# EasyEDA Pro project ProPrj_智能小车.epro

# Schematic Schematic1
Board Name: Board1; Create Date: 2025-06-21; Page Name: P1; Project Name: 智能小车; Schematic Name: Schematic1; Update Date: 2025-06-22; Company: 西安电子科技大学; Drawed: 王舒贤; Page Size: A4; Version: V1.0
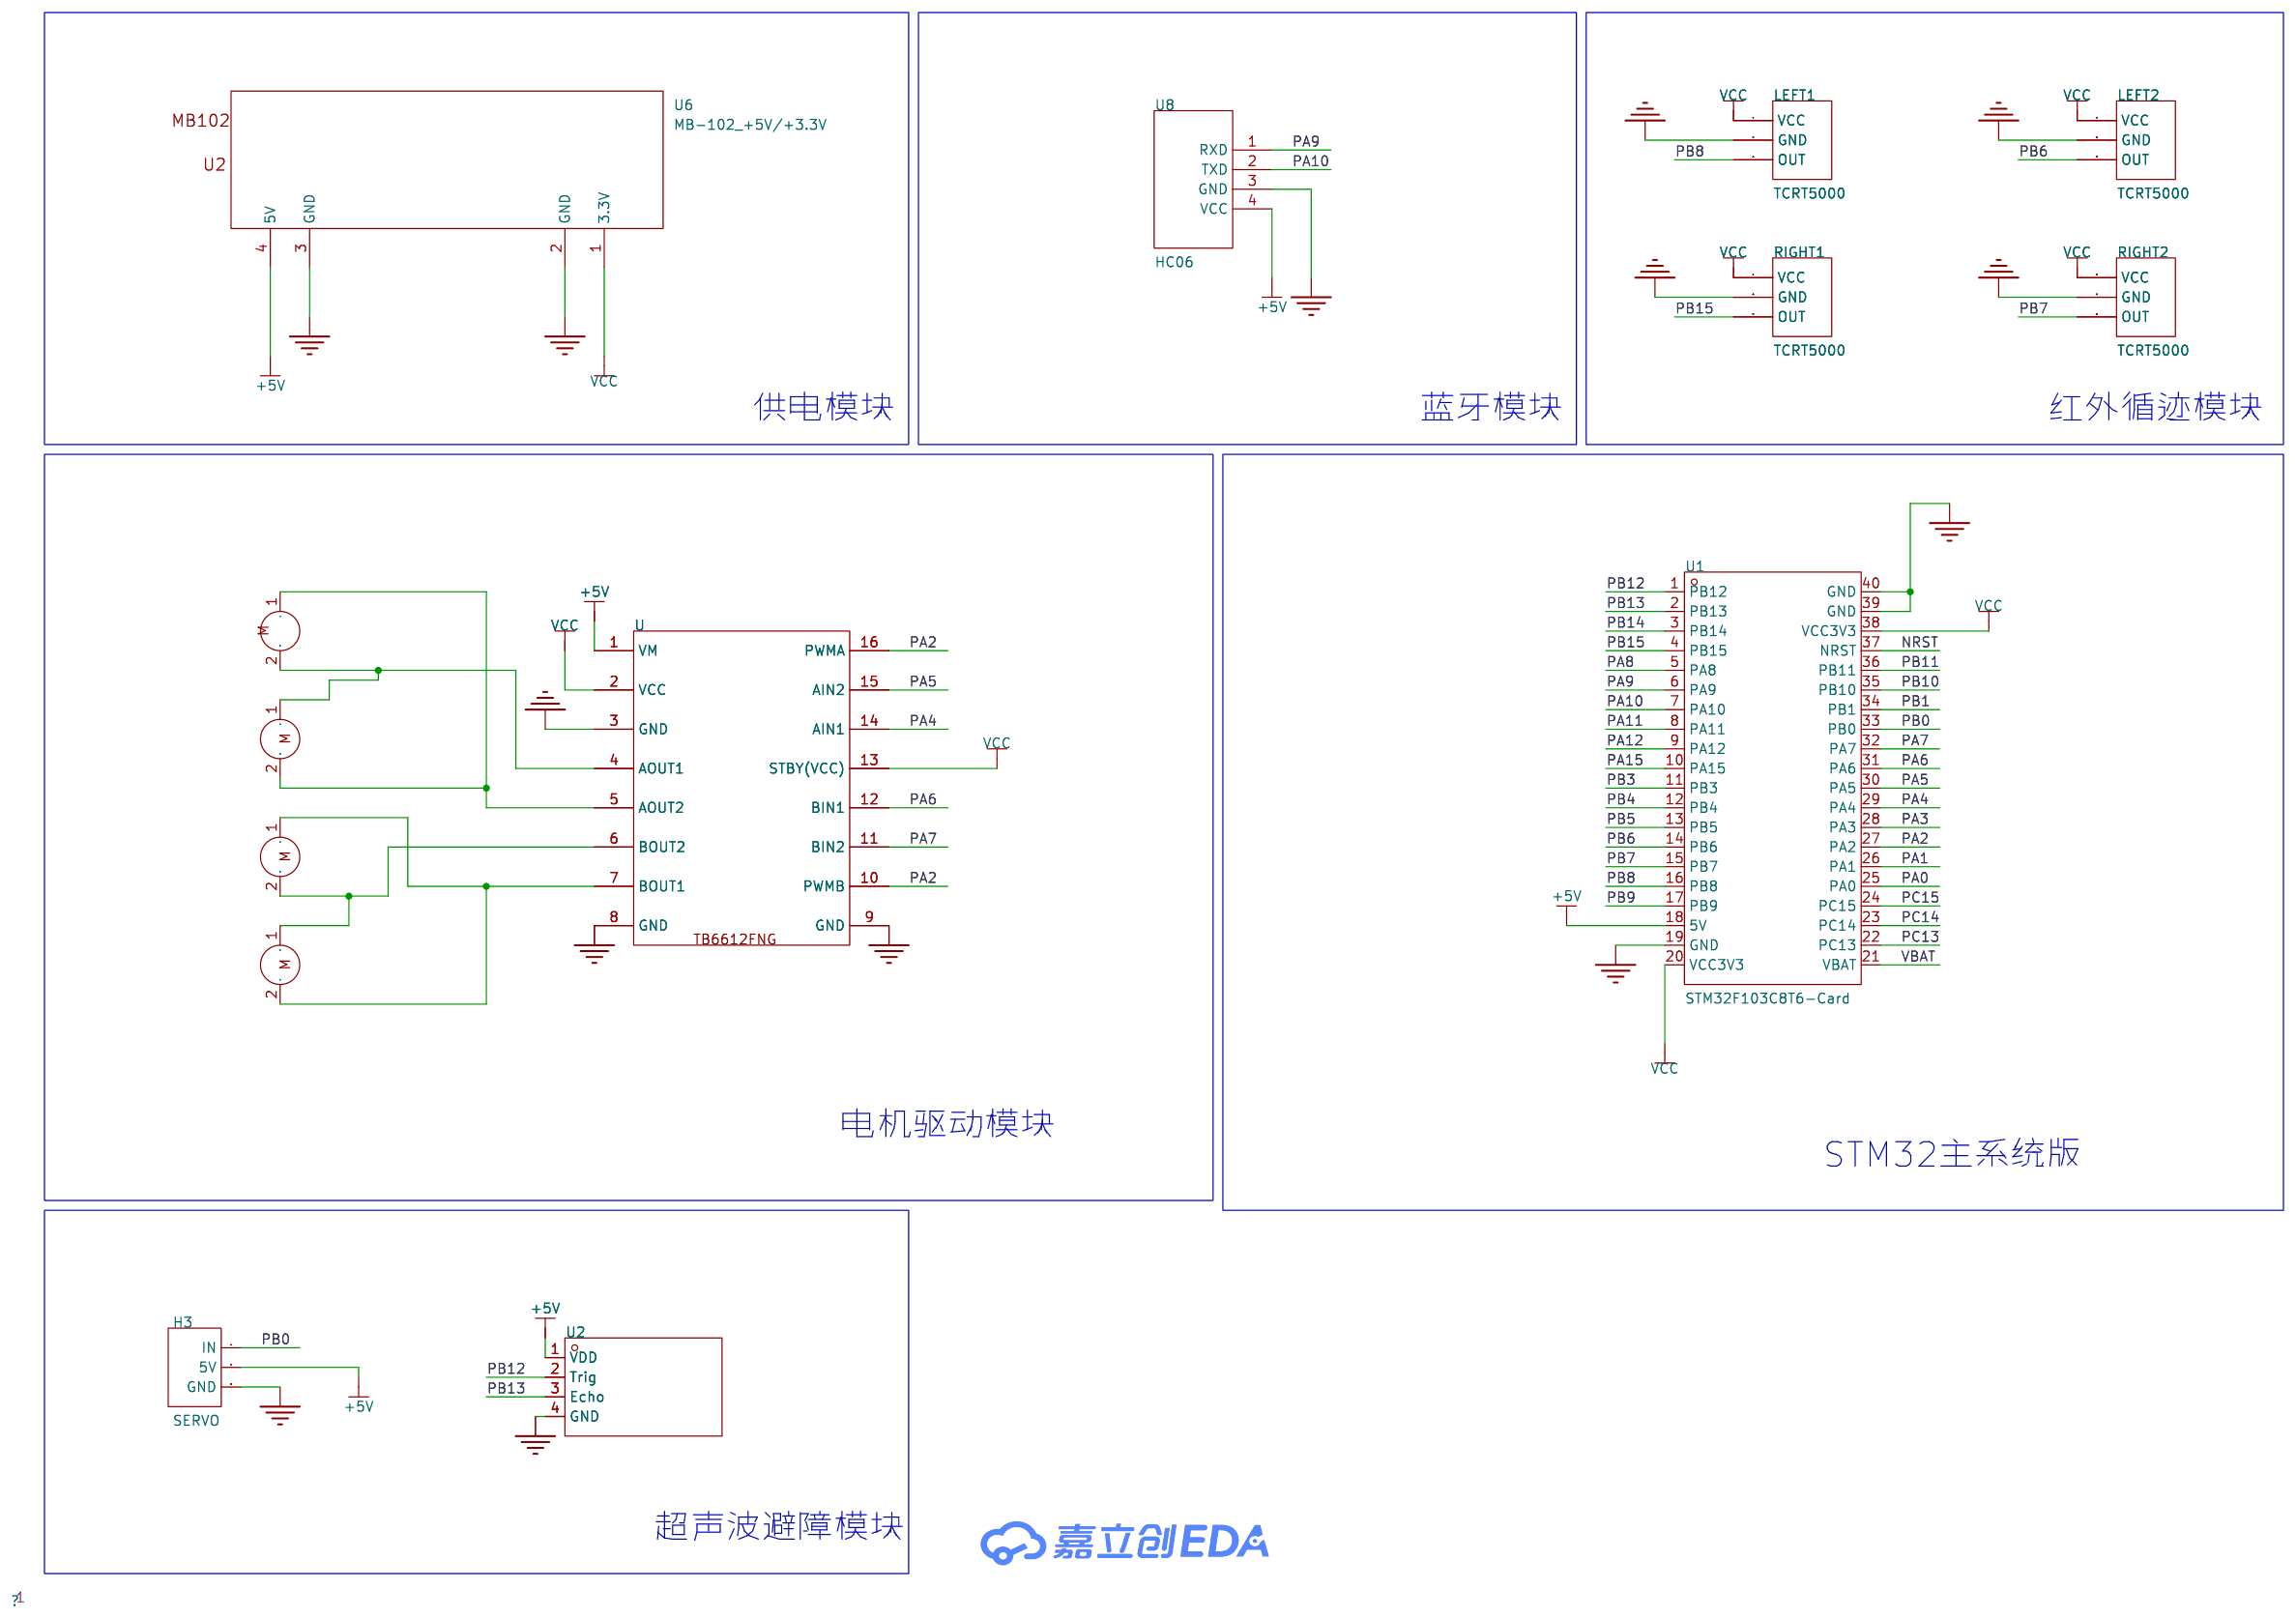
[diagram p0: schematic sheet]

## Parts
H3  SERVO  [SERVO]
LEFT1  TCRT5000  [footprint_0961]
LEFT2  TCRT5000  [footprint_0961]
LEFT3  DC 12V  [电源端子-2P]
LEFT4  DC 12V  [电源端子-2P]
RIGHT1  TCRT5000  [footprint_0961]
RIGHT2  TCRT5000  [footprint_0961]
RIGHT3  DC 12V  [电源端子-2P]
RIGHT4  DC 12V  [电源端子-2P]
U  -  [TB6612FNG]
U1  STM32F103C8T6-Card  [CONN-TH_L53.3-W22.9_STM32F103C8T6-CARD]
U2  -  [HC-SR04]
U6  MB-102_+5V/+3.3V  [MB-102_+5V/+3.3V]
U8  HC06  [HC06]

## Library data of the parts
H3 = SERVO: link: https://item.szlcsc.com/50265.html; 3DModel: HDR-M-2.54_1x3; Supplier: LCSC; Manufacturer: BOOMELE; Manufacturer Part: Header2.54mm 1*3P; Supplier Part: C49257; JLCPCB Part Class: Extended Part; _: 3
LEFT1 LEFT2 RIGHT1 RIGHT2 = TCRT5000
LEFT3 LEFT4 RIGHT3 RIGHT4 = 直流电机
U = TB6612
U1 = STM32F103C8T6-Card: Supplier Part: C9900077949; Supplier Footprint: 插件; Supplier: LCSC
U2 = HC-SR04: _: 3
U6 = MB-102_+5V/+3.3V
U8 = HC06

## Nets
+5V: H3.2(5V) U.1(VM) U1.18(5V) U2.1(VDD) U6.4(5V) U8.4(VCC)
GND: H3.3(GND) LEFT1.2(GND) LEFT2.2(GND) RIGHT1.2(GND) RIGHT2.2(GND) U.3(GND) U.8(GND) U.9(GND) U1.19(GND) U1.39(GND) U1.40(GND) U2.4(GND) U6.2(GND) U6.3(GND) U8.3(GND)
VBAT: U1.21(VBAT)
VCC: LEFT1.1(VCC) LEFT2.1(VCC) RIGHT1.1(VCC) RIGHT2.1(VCC) U.2(VCC) U.13(STBY(VCC)) U1.20(VCC3V3) U1.38(VCC3V3) U6.1(3.3V)
NRST: U1.37(NRST)
PA0: U1.25(PA0)
PA1: U1.26(PA1)
PA2: U.10(PWMB) U.16(PWMA) U1.27(PA2)
PA3: U1.28(PA3)
PA4: U.14(AIN1) U1.29(PA4)
PA5: U.15(AIN2) U1.30(PA5)
PA6: U.12(BIN1) U1.31(PA6)
PA7: U.11(BIN2) U1.32(PA7)
PA8: U1.5(PA8)
PA9: U1.6(PA9) U8.1(RXD)
PA10: U1.7(PA10) U8.2(TXD)
PA11: U1.8(PA11)
PA12: U1.9(PA12)
PA15: U1.10(PA15)
PB0: H3.1(IN) U1.33(PB0)
PB1: U1.34(PB1)
PB3: U1.11(PB3)
PB4: U1.12(PB4)
PB5: U1.13(PB5)
PB6: LEFT2.3(OUT) U1.14(PB6)
PB7: RIGHT2.3(OUT) U1.15(PB7)
PB8: LEFT1.3(OUT) U1.16(PB8)
PB9: U1.17(PB9)
PB10: U1.35(PB10)
PB11: U1.36(PB11)
PB12: U1.1(PB12) U2.2(Trig)
PB13: U1.2(PB13) U2.3(Echo)
PB14: U1.3(PB14)
PB15: RIGHT1.3(OUT) U1.4(PB15)
PC13: U1.22(PC13)
PC14: U1.23(PC14)
PC15: U1.24(PC15)
$1N4695: LEFT3.2 LEFT4.1 U.6(BOUT2)
$1N4704: LEFT3.1 LEFT4.2 U.7(BOUT1)
$1N4739: RIGHT3.2 RIGHT4.1 U.4(AOUT1)
$1N4745: RIGHT3.1 RIGHT4.2 U.5(AOUT2)

## Notes on the sheet
- 供电模块
- 蓝牙模块
- 红外循迹模块
- 电机驱动模块
- STM32主系统版
- 超声波避障模块

# Board PCB1
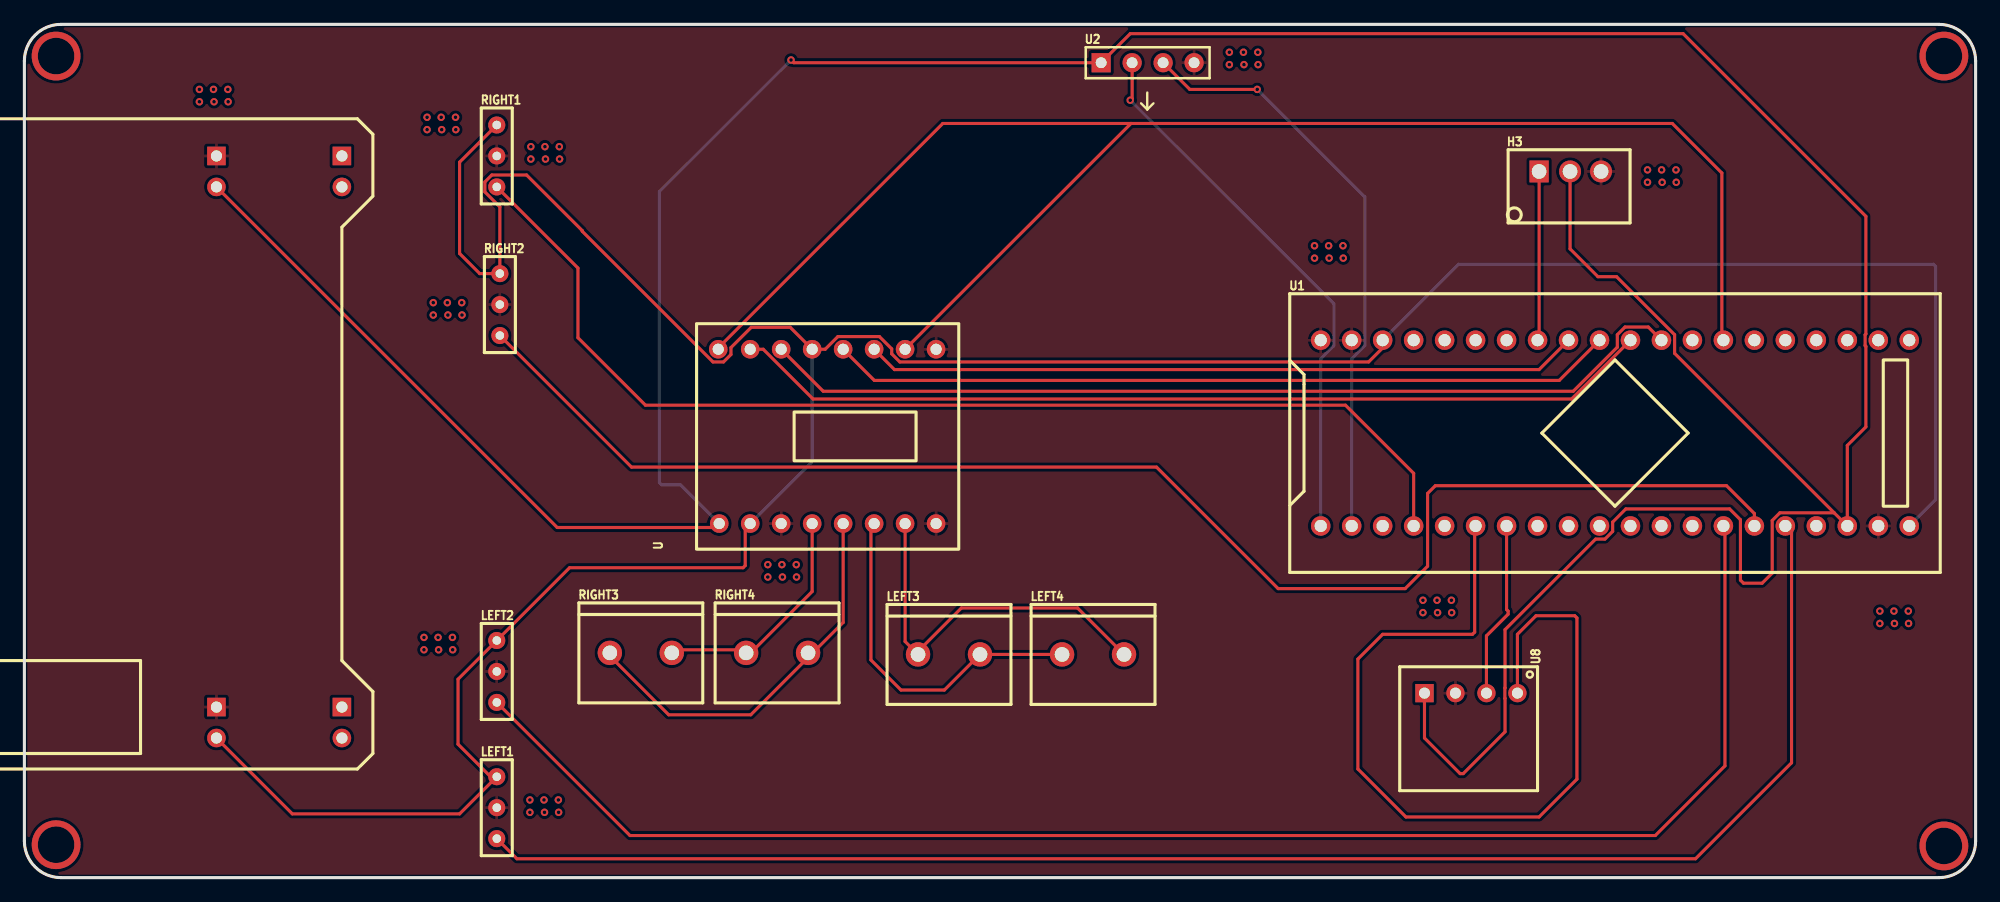
[diagram p1: board, top side]
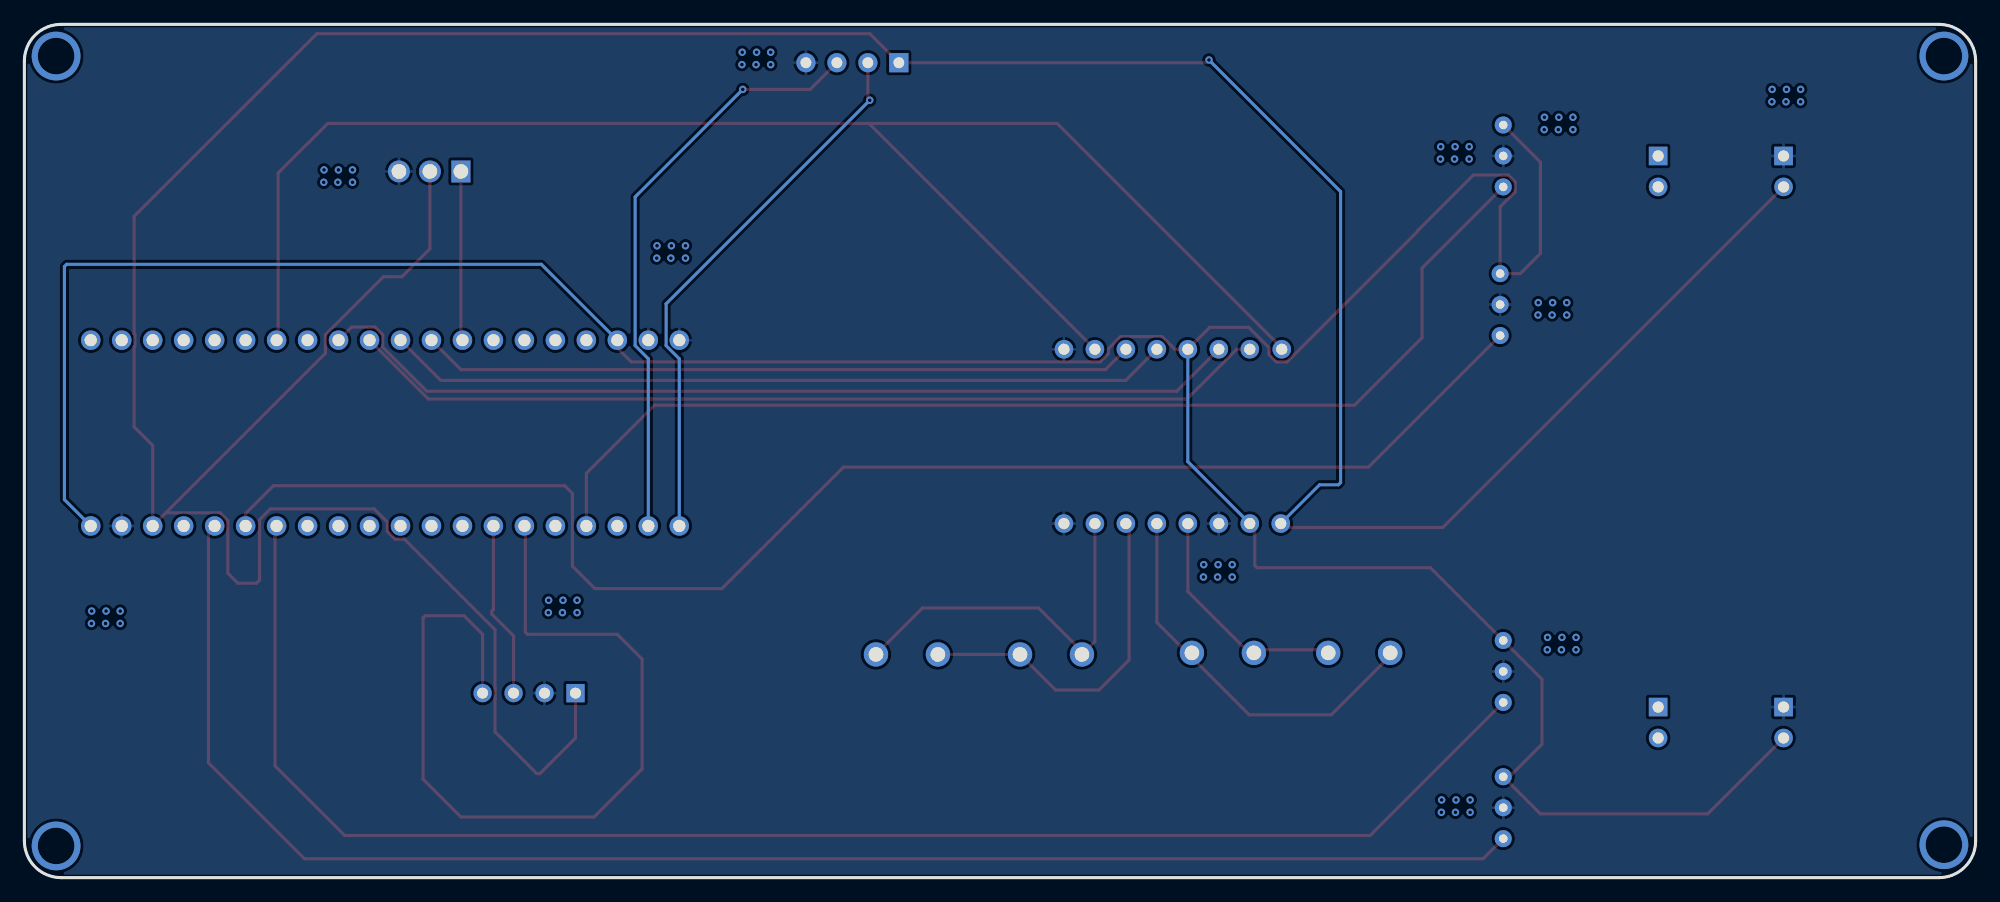
[diagram p2: board, bottom side, seen from below]

Outline 160 x 70 mm; copper layers: Top Layer, Bottom Layer. Coordinates in mm from the lower left corner of the outline.
Outline path: 0,67 0,3 arc(0.88,0.88) 3,0 157,0 arc(159.12,0.88) 160,3 160,67 arc(159.12,69.12) 157,70 3,70 arc(0.88,69.12) 0,67
Stack: Top Layer 0.035mm / Dielectric1 1.51mm FR4 er 4.5 / Bottom Layer 0.035mm

## Design rules (mm)
template: 自定义配置
spacing copperThickness1oz (default): track to track 0.102, other pairs 0.152 to 0.3
spacing copperThickness2oz: track to track 0.203, other pairs 0.152 to 0.3
track width copperThickness1oz (default): min 0.127, default 0.254, max 2.54
track width copperThickness2oz: min 0.203, default 0.254, max 2.54
differential pair differentialPair (default): width min 0.127, default 0.254, max 2.54; gap min 0.152, default 0.152
via viaSize (default): diameter min 0.5, default 0.61, max 10; hole min 0.3, default 0.305, max 6.3

## Placement (name value [footprint] x y rotation side)
H3  -  [SERVO]  126.75 57.94 0 top
LEFT1  TCRT5000  [footprint_0961]  38.73 8.28 0 top
LEFT2  TCRT5000  [footprint_0961]  38.73 19.45 0 top
LEFT3  DC 12V  [电源端子-2P]  75.82 18.31 0 top
LEFT4  DC 12V  [电源端子-2P]  87.63 18.31 0 top
RIGHT1  TCRT5000  [footprint_0961]  38.73 61.75 0 top
RIGHT2  TCRT5000  [footprint_0961]  38.99 49.55 0 top
RIGHT3  DC 12V  [电源端子-2P]  50.55 18.44 0 top
RIGHT4  DC 12V  [电源端子-2P]  61.72 18.44 0 top
U  -  [TB6612FNG]  55.12 26.95 90 top
U1  STM32F103C8T6-Card  [CONN-TH_L53.3-W22.9_STM32F103C8T6-CARD]  130.43 36.47 0 top
U2  -  [HC-SR04]  92.07 66.83 0 top
U6  -  [MB-102_+5V/+3.3V]  14.1 36.98 90 top
U8  -  [HC06]  124.08 17.3 270 top

## Footprints (pads in the part's own frame, mm; a bottom-side part is the same pattern mirrored in y, then rotated)
CONN-TH_L53.3-W22.9_STM32F103C8T6-CARD
  round 1.6 hole 1: 1(-24.13,-7.62) 2(-21.59,-7.62) 3(-19.05,-7.62) 4(-16.51,-7.62) 5(-13.97,-7.62) 6(-11.43,-7.62) 7(-8.89,-7.62) 8(-6.35,-7.62) 9(-3.81,-7.62) 10(-1.27,-7.62) 11(1.27,-7.62) 12(3.81,-7.62) 13(6.35,-7.62) 14(8.89,-7.62) 15(11.43,-7.62) 16(13.97,-7.62) 17(16.51,-7.62) 18(19.05,-7.62) 19(21.59,-7.62) 20(24.13,-7.62) 21(24.13,7.62) 22(21.59,7.62) 23(19.05,7.62) 24(16.51,7.62) 25(13.97,7.62) 26(11.43,7.62) 27(8.89,7.62) 28(6.35,7.62) 29(3.81,7.62) 30(1.27,7.62) 31(-1.27,7.62) 32(-3.81,7.62) 33(-6.35,7.62) 34(-8.89,7.62) 35(-11.43,7.62) 36(-13.97,7.62) 37(-16.51,7.62) 38(-19.05,7.62) 39(-21.59,7.62) 40(-24.13,7.62)
footprint_0961
  round 1.4 hole 0.7: 1(0,0) 2(0,-2.54) 3(0,-5.08)
HC06
  round 1.5 hole 0.9: 1(2.159,-1.651) 2(2.159,-4.191) 3(2.159,-6.731)
  rect 1.5x1.5 hole 0.9: 4(2.159,-9.271)
HC-SR04
  rect 1.575x1.575 hole 0.889: 1(-3.78,0.03)
  round 1.575 hole 0.889: 2(-1.24,0.03) 3(1.3,0.03) 4(3.84,0.03)
MB-102_+5V/+3.3V
  round 1.524 hole 0.914: 1(-25.527,-1.651) 4(19.685,-1.651) 6(19.685,-11.938) 7(-25.527,-11.938)
  rect 1.524x1.524 hole 0.914: 2(-22.987,-1.651) 3(22.225,-1.651) 5(22.225,-11.938) 8(-22.987,-11.938)
SERVO
  rect 1.575x1.8 hole 1.2: 1(-2.54,0)
  round 1.8 hole 1.2: 2(0,0) 3(2.54,0)
TB6612FNG
  round 1.524 hole 0.914: 1(2.1,-1.86) 2(2.1,-4.4) 3(2.1,-6.94) 4(2.1,-9.48) 5(2.1,-12.02) 6(2.1,-14.56) 7(2.1,-17.1) 8(2.1,-19.64) 9(16.4,-19.64) 10(16.4,-17.1) 11(16.4,-14.56) 12(16.4,-12.02) 13(16.4,-9.48) 14(16.4,-6.94) 15(16.4,-4.4) 16(16.4,-1.778)
电源端子-2P
  round 2 hole 1.2: 1(-2.54,0) 2(2.54,0)

## Nets
As in the schematic.

Pads without a net: U6 5 6 7 8

## Via types
v1: diameter 0.61, hole 0.305, Top Layer to Bottom Layer, 75 vias
v2: diameter 4, hole 3, Top Layer to Bottom Layer, 4 vias

## Routing (per net, layer and track width the routed paths; a pad name or vN(x,y) marks a point on that pad's centre or on a via; arc(x,y) is an arc through that point)
+5V: length 322.5
  Top Layer w0.254: 148.4,29.93 U1.18 149.48,35.46 151,36.98 151,43.58 150.94,43.64 150.94,44.54 151,44.6 151,54.25 136.02,69.24 90.68,69.24 U2.1 63.09,66.86 v1(62.87,67.08) ; 148.4,29.93 143.95,29.93 143.32,29.3 143.32,24.98 142.49,24.15 140.97,24.15 140.72,24.41 140.72,29.36 139.83,30.25 131.32,30.25 130.24,29.17 130.24,28.41 129.61,27.77 128.84,27.77 121.41,20.34 121.41,15.58 121.4,15.56 121.4,14.71 121.41,14.7 121.41,11.96 117.98,8.53 117.73,8.53 114.81,11.45 U8.4 ; 148.4,29.93 135.32,43.01 135.32,44.54 130.56,49.3 129.03,49.3 126.75,51.58 H3.2 ; U.1 56.66,28.72 43.69,28.72 U6.4
  Bottom Layer w0.254: v1(62.87,67.08) 52.07,56.28 52.07,32.41 52.25,32.23 53.8,32.23 U.1
VCC: length 263
  Top Layer w0.254: U.2 59.11,28.64 59.11,25.6 58.93,25.42 44.7,25.42 LEFT2.1 35.56,16.28 35.56,10.94 38.23,8.28 LEFT1.1 35.69,5.23 21.97,5.23 U6.1 ; U1.38 111.38,43.46 110.23,42.31 71.79,42.31 71.12,42.97 71.12,43.38 70.11,44.39 66.71,44.39 65.67,43.35 U.13 62.8,45.15 59.6,45.15 57.94,43.48 57.94,42.92 57.33,42.31 56.47,42.31 45.75,53.02 45.75,53.08 41.18,57.64 38.33,57.64 37.76,57.07 37.76,56.26 38.99,55.03 RIGHT2.1 37.34,49.55 35.69,51.2 35.69,58.7 RIGHT1.1
  Bottom Layer w0.254: U.13 64.6,34.13 U.2 ; U1.38 117.6,50.31 156.54,50.31 156.72,50.14 156.72,31.01 U1.20
(no net):
  vias: v1(14.35,64.67) v1(14.35,63.65) v1(15.51,64.67) v1(15.55,63.65) v1(16.69,64.67) v1(16.71,63.65) v1(32.77,19.71) v1(32.77,18.69) v1(33.02,62.38) v1(33.02,61.36) v1(33.53,47.17) v1(33.53,46.15) v1(33.92,19.71) v1(33.97,18.69) v1(34.18,62.38) v1(34.22,61.36) v1(34.68,47.17) v1(34.73,46.15) v1(35.1,19.71) v1(35.12,18.69) v1(35.35,62.38) v1(35.38,61.36) v1(35.86,47.17) v1(35.88,46.15) v1(41.53,59.97) v1(41.53,58.95) v1(41.45,6.37) v1(41.45,5.36) v1(42.61,6.37) v1(42.68,59.97) v1(42.73,58.95) v1(42.65,5.36) v1(43.78,6.37) v1(43.81,5.36) v1(43.86,59.97) v1(43.88,58.95) v1(60.96,25.68) v1(60.96,24.66) v1(62.12,25.68) v1(62.16,24.66) v1(63.29,25.68) v1(63.32,24.66) v1(98.81,67.71) v1(98.81,66.7) v1(99.96,67.71) v1(100,66.7) v1(101.14,67.71) v1(101.16,66.7) v1(105.79,51.84) v1(105.79,50.82) v1(106.95,51.84) v1(106.99,50.82) v1(108.12,51.84) v1(108.15,50.82) v1(114.68,22.76) v1(114.68,21.74) v1(115.84,22.76) v1(115.88,21.74) v1(117.01,22.76) v1(117.04,21.74) v1(133.1,58.06) v1(133.1,57.05) v1(134.25,58.06) v1(134.29,57.05) v1(135.43,58.06) v1(135.45,57.05) v1(152.15,21.87) v1(152.15,20.85) v1(153.3,21.87) v1(153.34,20.85) v1(154.48,21.87) v1(154.5,20.85) v2(2.6,67.4) v2(2.6,2.7) v2(157.4,67.4) v2(157.4,2.6)
PA2: length 131.7
  Top Layer w0.254: U1.27 139.19,44.22 139.19,57.81 135.13,61.87 90.74,61.87 ; U.16 56.9,43.46 75.31,61.87 90.74,61.87 ; 90.74,61.87 U.10
PA4: length 76.8
  Top Layer w0.254: U1.29 133.16,45.17 131.25,45.17 130.62,44.54 130.62,43.52 127,39.9 65.5,39.9 U.14
PA5: length 75.9
  Top Layer w0.254: U.15 60.59,43.35 64.67,39.27 126.87,39.27 U1.30
PA6: length 64.4
  Top Layer w0.254: U.12 69.69,40.79 125.86,40.79 U1.31
PA7: length 58.6
  Top Layer w0.254: U.11 71.35,41.68 124.21,41.68 U1.32
PA9: length 72.8
  Top Layer w0.254: U1.6 118.92,28.78 118.92,20.14 118.75,19.96 111.38,19.96 109.35,17.93 109.35,8.91 113.28,4.98 124.21,4.98 127.31,8.08 127.31,21.31 127.13,21.49 123.95,21.49 122.43,19.96 U8.1
PA10: length 14.5
  Top Layer w0.254: U1.7 121.54,21.99 121.67,21.87 121.67,21.61 119.89,19.83 U8.2
PB0: length 13.9
  Top Layer w0.254: H3.1 124.21,44.22 U1.33
PB6: length 127.3
  Top Layer w0.254: U1.14 139.45,28.72 139.45,9.17 133.73,3.45 49.66,3.45 LEFT2.3
PB7: length 120.4
  Top Layer w0.254: RIGHT2.3 49.78,33.68 92.84,33.68 102.81,23.71 113.22,23.71 115.06,25.55 115.06,31.52 115.7,32.15 139.57,32.15 141.86,29.87 U1.15
PB8: length 129.8
  Top Layer w0.254: U1.16 144.91,28.34 144.91,9.42 137.03,1.55 40.39,1.55 LEFT1.3
PB12: length 45.4
  Top Layer w0.254: v1(90.68,63.78) 90.84,63.93 90.84,66.86
  Bottom Layer w0.254: v1(90.68,63.78) 107.38,47.08 107.38,43.64 106.3,42.57 U1.1
PB13: length 48.5
  Top Layer w0.254: v1(101.09,64.67) 95.56,64.67 U2.3
  Bottom Layer w0.254: U1.2 108.84,42.57 109.92,43.64 109.92,55.84 v1(101.09,64.67)
PB15: length 92.6
  Top Layer w0.254: U1.4 113.92,33.17 108.33,38.76 50.93,38.76 45.39,44.29 45.39,50.01 RIGHT1.3
$1N4695: length 29.2
  Top Layer w0.254: U.6 69.42,28.79 69.42,17.86 71.88,15.39 75.44,15.39 78.36,18.31 LEFT4.1
$1N4704: length 31.4
  Top Layer w0.254: U.7 72.22,19.37 LEFT3.1 73.28,18.56 76.84,22.12 86.36,22.12 LEFT4.2
$1N4739: length 19.8
  Top Layer w0.254: U.4 64.6,23.47 59.56,18.44 59.31,18.44 59.06,18.69 52.58,18.69
$1N4745: length 33.1
  Top Layer w0.254: U.5 67.14,20.93 59.56,13.36 52.83,13.36 47.5,18.69

## Copper pours and planes (outline as drawn; the poured copper is in the pictures)
GND on Top Layer: -8.51,74.7 165.99,74.7 165.99,-7.72 -8.51,-7.72
GND on Top Layer: -12.95,80.29 173.74,80.29 173.74,-23.22 -12.95,-23.22
GND on Bottom Layer: -12.45,82.32 181.61,82.32 181.61,-18.9 -12.45,-18.9
GND on Bottom Layer: -20.45,83.72 178.56,83.72 178.56,-19.15 -20.45,-19.15
